# EAGLE schematic LTCSensorIndex (EAGLE 6.4)
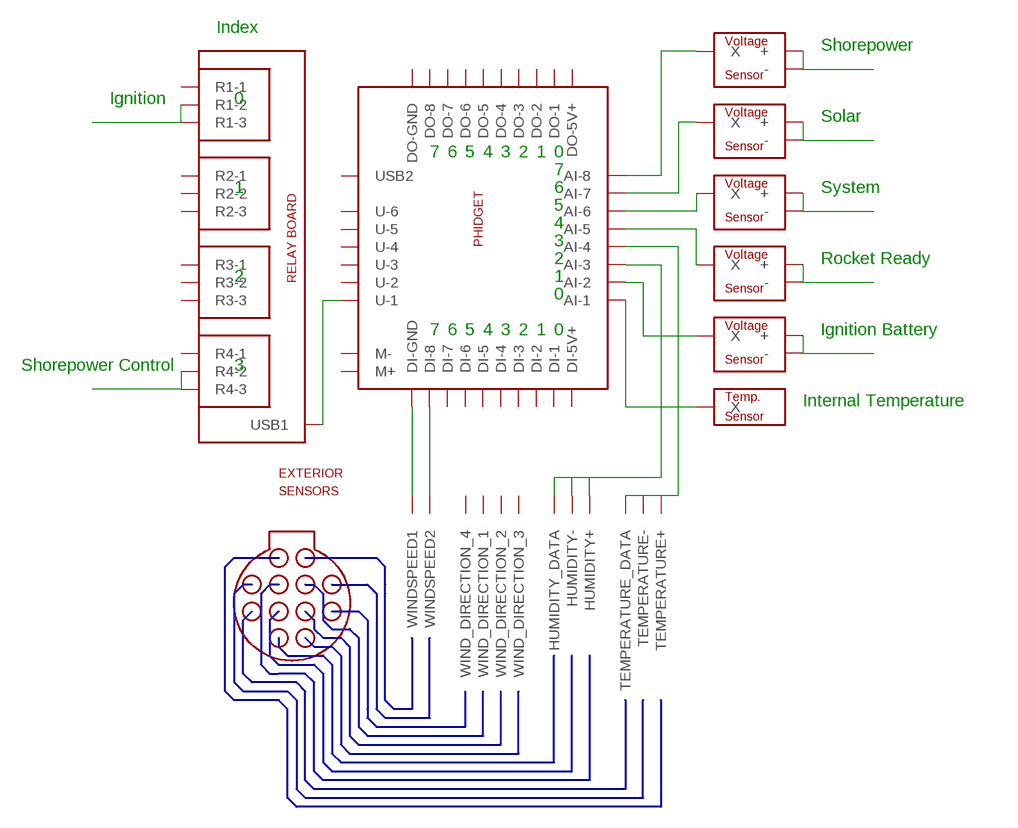
[diagram p0: schematic, sheet 1]

## Parts
U$1  LAYOUT-PHIDGET  [LAYOUT-PACKAGE]
U$2  LAYOUT-SENSOR-TEMPERATURE  [LAYOUT-PACKAGE]
U$3  LAYOUT-SENSOR-VOLTAGE  [LAYOUT-PACKAGE]
U$4  LAYOUT-SENSOR-VOLTAGE  [LAYOUT-PACKAGE]
U$5  LAYOUT-SENSOR-VOLTAGE  [LAYOUT-PACKAGE]
U$6  LAYOUT-SENSOR-VOLTAGE  [LAYOUT-PACKAGE]
U$7  LAYOUT-SENSOR-VOLTAGE  [LAYOUT-PACKAGE]
U$8  LAYOUT-RELAY-BOARD  [LAYOUT-PACKAGE]
U$9  LAYOUT-LEMO-12PIN  [LEMO-12]

## Nets
IGNITION: U$8.P$22(R1-3) U$8.P$23(R1-2)
IGNITION_BATTERY: U$6.P$1(+) U$6.P$2(-)
N$1: U$1.P$31(U-1) U$8.P$12(USB1)
N$2: U$1.P$18(DI-GND) U$9.P6(WINDSPEED1)
N$3: U$1.P$17(DI-8) U$9.P5(WINDSPEED2)
N$4: U$1.P$3(AI-3) U$9.P2(HUMIDITY_DATA) U$9.P9(HUMIDITY-) U$9.P12(HUMIDITY+)
N$5: U$1.P$4(AI-4) U$9.P7(TEMPERATURE_DATA)
N$6: U$1.P$1(AI-1) U$2.P$1(X)
N$7: U$1.P$2(AI-2) U$6.P$3(X)
N$8: U$1.P$5(AI-5) U$5.P$3(X)
N$9: U$1.P$6(AI-6) U$4.P$3(X)
N$10: U$1.P$7(AI-7) U$3.P$3(X)
N$11: U$1.P$8(AI-8) U$7.P$3(X)
N$12: U$8.P$13(R4-3) U$8.P$14(R4-2)
ROCKET_READY: U$5.P$1(+) U$5.P$2(-)
SHOREPOWER: U$7.P$1(+) U$7.P$2(-)
SOLAR: U$3.P$1(+) U$3.P$2(-)
SYSTEM: U$4.P$1(+) U$4.P$2(-)
Unconnected: U$1.P$9(DI-1) U$1.P$10(DI-2) U$1.P$11(DI-3) U$1.P$12(DI-4) U$1.P$13(DI-5) U$1.P$14(DI-5V+) U$1.P$15(DI-6) U$1.P$16(DI-7) U$1.P$19(DO-1) U$1.P$20(DO-2) U$1.P$21(DO-3) U$1.P$22(DO-4) U$1.P$23(DO-5) U$1.P$24(DO-5V+) U$1.P$25(DO-6) U$1.P$26(DO-7) U$1.P$27(DO-8) U$1.P$28(DO-GND) U$1.P$29(M+) U$1.P$30(M-) U$1.P$32(U-2) U$1.P$33(U-3) U$1.P$34(U-4) U$1.P$35(U-5) U$1.P$36(U-6) U$1.P$37(USB2) U$8.P$15(R4-1) U$8.P$16(R3-3) U$8.P$17(R3-2) U$8.P$18(R3-1) U$8.P$19(R2-3) U$8.P$20(R2-2) U$8.P$21(R2-1) U$8.P$24(R1-1) U$9.P1(TEMPERATURE+) U$9.P3(WIND_DIRECTION_3) U$9.P4(WIND_DIRECTION_4) U$9.P8(TEMPERATURE-) U$9.P10(WIND_DIRECTION_2) U$9.P11(WIND_DIRECTION_1)

## Notes on the sheet
- Index
- Shorepower
- Ignition | 0
- Solar
- 7 | 6 | 5 | 4 | 3 | 2 | 1 | 0
- 7
- 1 | 6 | System
- 5
- 4
- 3
- 2 | Rocket Ready
- 2 | 1
- 0
- 7 | 6 | 5 | 4 | 3 | 2 | 1 | 0 | Ignition Battery
- Shorepower Control | 3
- Internal Temperature

## Library data of the parts
U$1 = launch-tower:LAYOUT-PHIDGET
U$2 = launch-tower:LAYOUT-SENSOR-TEMPERATURE
U$3-U$7 = launch-tower:LAYOUT-SENSOR-VOLTAGE
U$8 = launch-tower:LAYOUT-RELAY-BOARD
U$9 = launch-tower:LAYOUT-LEMO-12PIN